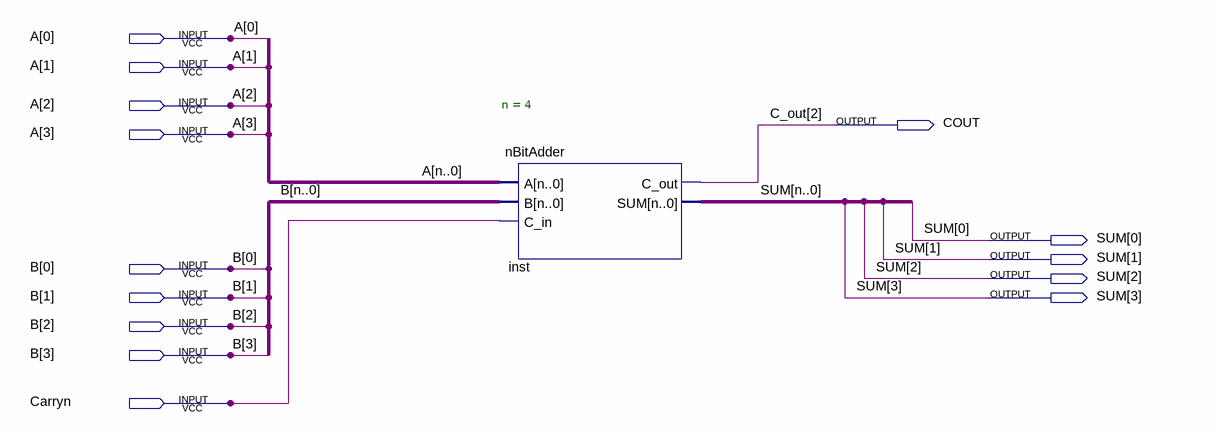
[diagram p0: schematic sheet]
// Quartus schematic nbitadder_top.bdf as structural Verilog: 1 symbols, 14 pins
module nbitadder_top (
  input  [3:0] A,
  input  [3:0] B,
  input  Carryn,
  output COUT,
  output [3:0] SUM
);

  wire \A[n..0] , \B[n..0] , \SUM[n..0] ;

  nBitAdder #(.n(4)) inst (.A({5{\A[n..0] }}), .B({5{\B[n..0] }}), .C_in(Carryn), .C_out(COUT), .SUM(\SUM[n..0] ));

  // Other names for the same wires on the sheet: C_out[2] = COUT
endmodule
